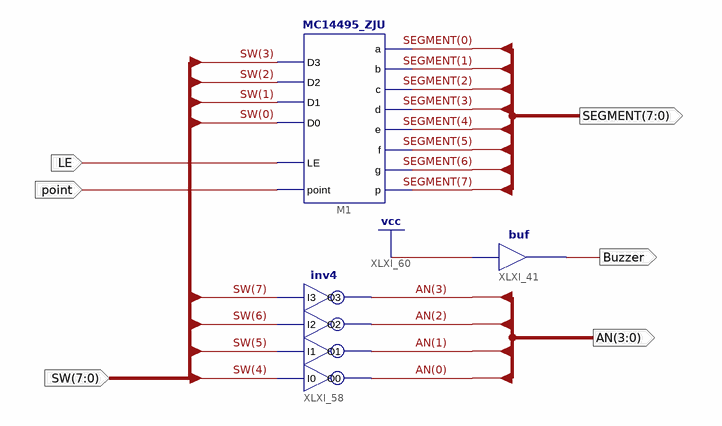
[diagram p0: schematic sheet 1]
// Xilinx ISE schematic Hex27Seg_sch.sch (kintex7) as structural Verilog: 3 symbols, 6 ports
module Hex27Seg_sch (
  input  [7:0] SW,
  input  LE,
  input  point,
  output [3:0] AN,
  output [7:0] SEGMENT,
  output Buzzer
);

  inv4 XLXI_58 (.I0(SW[4]), .I1(SW[5]), .I2(SW[6]), .I3(SW[7]), .O0(AN[0]), .O1(AN[1]), .O2(AN[2]), .O3(AN[3]));
  MC14495_ZJU M1 (
    .D0(SW[0]), .D1(SW[1]), .D2(SW[2]), .D3(SW[3]), .p(SEGMENT[7]), .g(SEGMENT[6]), .f(SEGMENT[5]),
    .e(SEGMENT[4]), .d(SEGMENT[3]), .c(SEGMENT[2]), .b(SEGMENT[1]), .a(SEGMENT[0]), .point(point), .LE(LE));
  buf XLXI_41 (Buzzer, 1'b1);
endmodule
